# EAGLE design Rocket-Control2 (EAGLE 7.6.0)
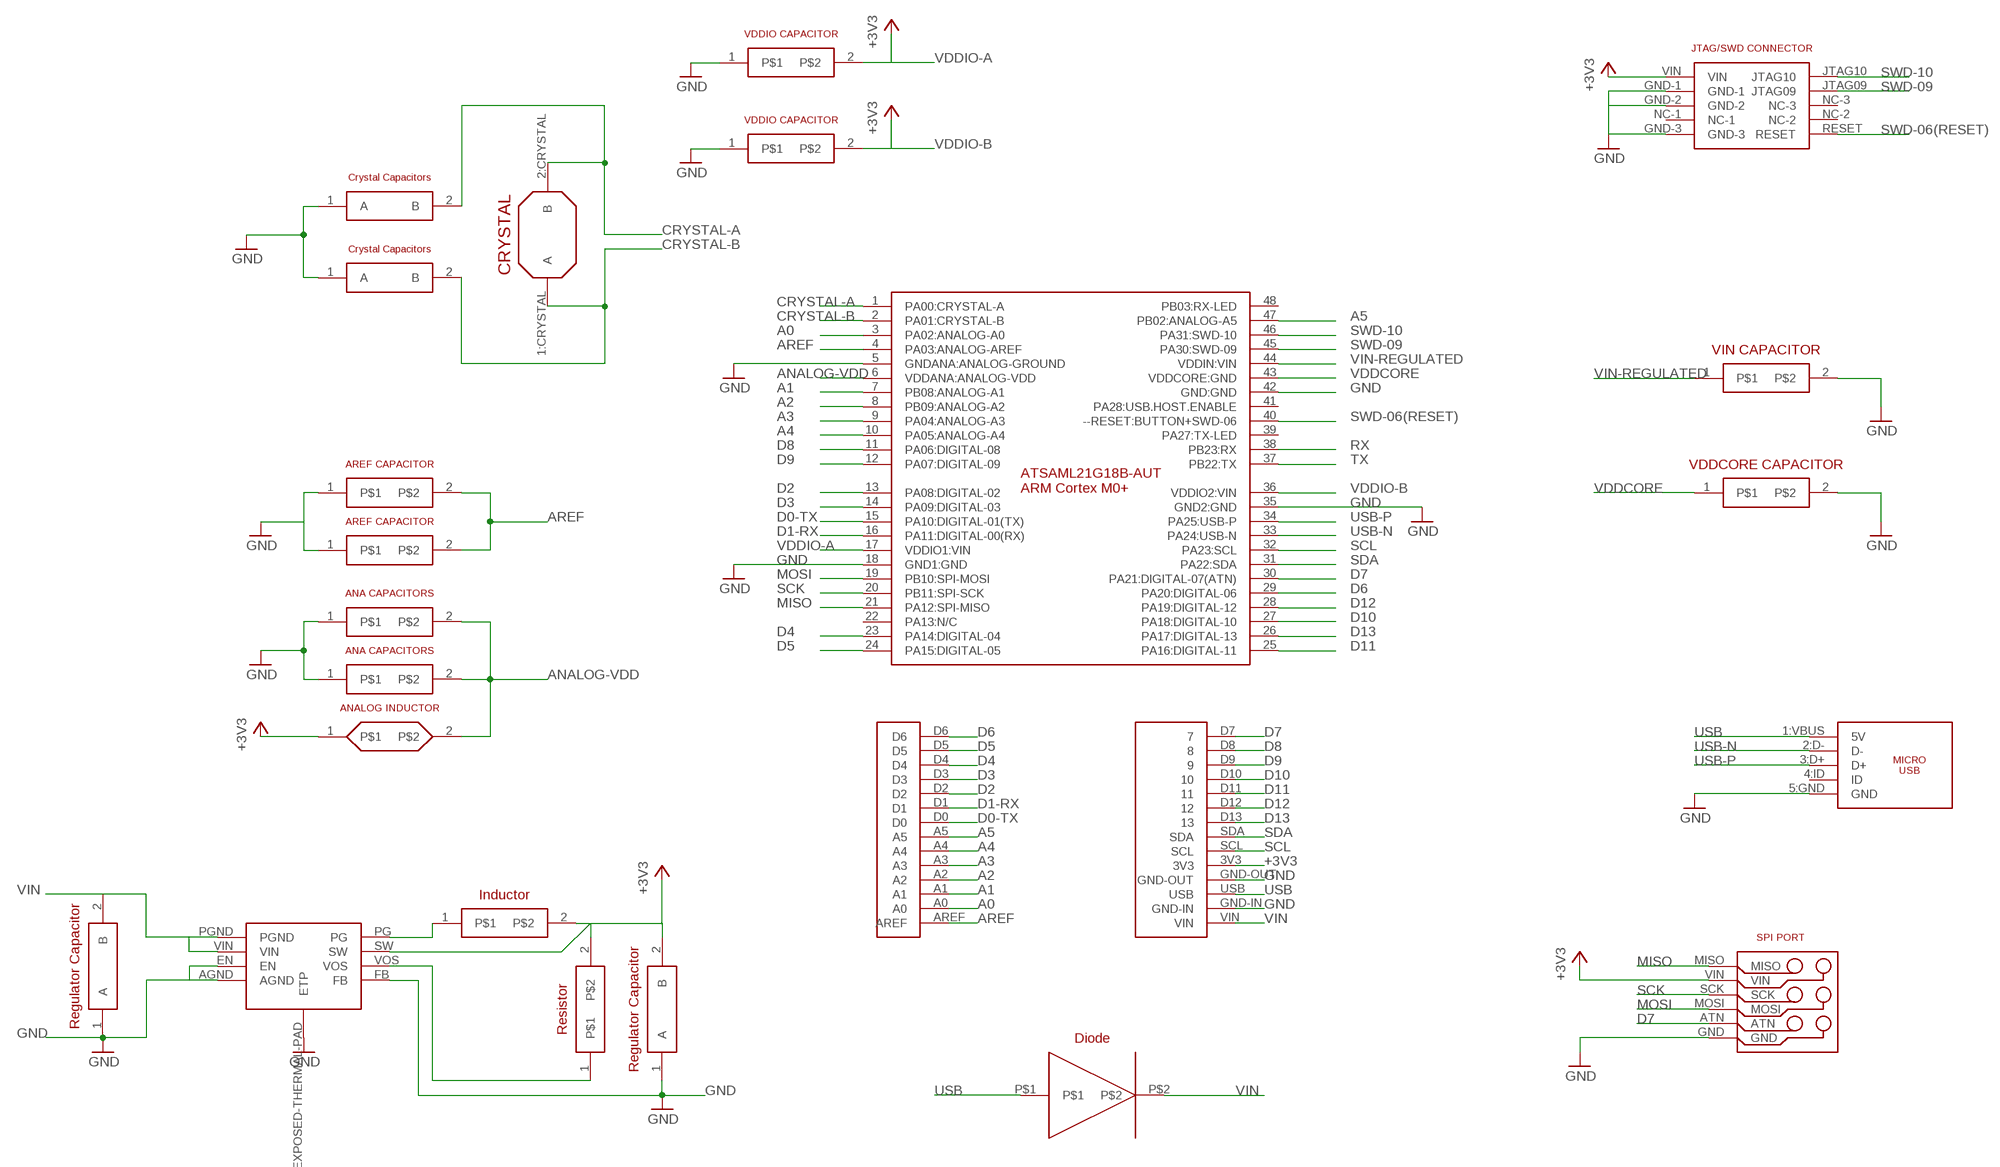
[diagram p0: schematic, sheet 1]

## Parts
U$1  ATSAML21G18B-AUT  [TQFP48]
U$2  CRYSTAL-CAPACITORS  [C0603]
U$3  CRYSTAL-CAPACITORS  [C0603]
U$4  CRYSTAL  [4-SOJ:CRYSTAL]
U$5  REGULATOR  [8-WFDFN-EXPOSED-PAD]
U$6  AREF-CAPACITORS  [C0603]
U$7  AREF-CAPACITORS  [C0603]
U$8  ANALOG-CAPACITORS  [C0603]
U$9  ANALOG-CAPACITORS  [C0603]
U$10  ANALOG-INDUCTOR  [C0603]
U$11  REGULATOR-CAPACITORS  [C0603]
U$12  REGULATOR-CAPACITORS  [C0603]
U$13  REGULATOR-INDUCTOR  [C0603]
U$14  REGULATOR-RESISTOR  [C0603]
U$15  REGULATION-DIODE  [SOD-882]
U$21  HEADER-SIDE-A  [HEADER-SIDE-A]
U$22  HEADER-SIDE-B  [HEADER-SIDE-B]
U$26  VDDIO-CAPACITOR  [C0603]
U$35  VDDIO-CAPACITOR  [C0603]
U$38  10118194-0001LF:MICRO-USB  [10118194-0001LF:MICRO-USB-B]
U$41  SPI-PORT  [SPI-PORT]
U$56  VDDCORE-CAPACITOR  [C0603]
U$57  VIN-CAPACITOR  [C0603]
U$61  JTAG-MINI  [JTAG-MINI]

## Nets
+3V3: U$5.SW U$10.1 U$12.2(B) U$13.2 U$14.2 U$22.3V3 U$41.VIN U$61.VIN
A0: U$1.3(PA02:ANALOG-A0) U$21.A0
A1: U$1.7(PB08:ANALOG-A1) U$21.A1
A2: U$1.8(PB09:ANALOG-A2) U$21.A2
A3: U$1.9(PA04:ANALOG-A3) U$21.A3
A4: U$1.10(PA05:ANALOG-A4) U$21.A4
A5: U$1.47(PB02:ANALOG-A5) U$21.A5
ANALOG-VDD: U$1.6(VDDANA:ANALOG-VDD) U$8.2 U$9.2 U$10.2
AREF: U$1.4(PA03:ANALOG-AREF) U$6.2 U$7.2 U$21.AREF
CRYSTAL-A: U$1.1(PA00:CRYSTAL-A) U$2.2(B) U$4.2:CRYSTAL(B)
CRYSTAL-B: U$1.2(PA01:CRYSTAL-B) U$3.2(B) U$4.1:CRYSTAL(A)
D0-TX: U$1.15(PA10:DIGITAL-01(TX)) U$21.D0
D1-RX: U$1.16(PA11:DIGITAL-00(RX)) U$21.D1
D2: U$1.13(PA08:DIGITAL-02) U$21.D2
D3: U$1.14(PA09:DIGITAL-03) U$21.D3
D4: U$1.23(PA14:DIGITAL-04) U$21.D4
D5: U$1.24(PA15:DIGITAL-05) U$21.D5
D6: U$1.29(PA20:DIGITAL-06) U$21.D6
D7: U$1.30(PA21:DIGITAL-07(ATN)) U$22.D7 U$41.ATN
D8: U$1.11(PA06:DIGITAL-08) U$22.D8
D9: U$1.12(PA07:DIGITAL-09) U$22.D9
D10: U$1.27(PA18:DIGITAL-10) U$22.D10
D11: U$1.25(PA16:DIGITAL-11) U$22.D11
D12: U$1.28(PA19:DIGITAL-12) U$22.D12
D13: U$1.26(PA17:DIGITAL-13) U$22.D13
GND: U$1.5(GNDANA:ANALOG-GROUND) U$1.18(GND1:GND) U$1.35(GND2:GND) U$1.42(GND:GND) U$2.1(A) U$3.1(A) U$5.AGND U$5.EN U$5.EXPOSED-THERMAL-PAD(ETP) U$5.FB U$6.1 U$7.1 U$8.1 U$9.1 U$11.1(A) U$12.1(A) U$22.GND-IN U$22.GND-OUT U$26.1 U$35.1 U$38.5:GND(GND) U$41.GND U$56.2 U$57.2 U$61.GND-1 U$61.GND-2 U$61.GND-3
MISO: U$1.21(PA12:SPI-MISO) U$41.MISO
MOSI: U$1.19(PB10:SPI-MOSI) U$41.MOSI
N$1: U$5.PG U$13.1
N$3: U$5.VOS U$14.1
RX: U$1.38(PB23:RX)
SCK: U$1.20(PB11:SPI-SCK) U$41.SCK
SCL: U$1.32(PA23:SCL) U$22.SCL
SDA: U$1.31(PA22:SDA) U$22.SDA
SWD-06(RESET): U$1.40(--RESET:BUTTON+SWD-06) U$61.RESET
SWD-09: U$1.45(PA30:SWD-09) U$61.JTAG09
SWD-10: U$1.46(PA31:SWD-10) U$61.JTAG10
TX: U$1.37(PB22:TX)
USB: U$15.P$1 U$22.USB U$38.1:VBUS(5V)
USB-N: U$1.33(PA24:USB-N) U$38.2:D-(D-)
USB-P: U$1.34(PA25:USB-P) U$38.3:D+(D+)
VDDCORE: U$1.43(VDDCORE:GND) U$56.1
VDDIO-A: U$1.17(VDDIO1:VIN) U$26.2 ; supply symbol labelled +3V3
VDDIO-B: U$1.36(VDDIO2:VIN) U$35.2 ; supply symbol labelled +3V3
VIN: U$5.PGND U$5.VIN U$11.2(B) U$15.P$2 U$22.VIN
VIN-REGULATED: U$1.44(VDDIN:VIN) U$57.1
Unconnected: U$1.22(PA13:N/C) U$1.39(PA27:TX-LED) U$1.41(PA28:USB.HOST.ENABLE) U$1.48(PB03:RX-LED) U$38.4:ID(ID) U$61.NC-1 U$61.NC-2 U$61.NC-3

## Library data of the parts
U$1 = RocketControlBoard:ATSAML21G18B-AUT
U$2 U$3 = RocketControlBoard:CRYSTAL-CAPACITORS
U$4 = RocketControlBoard:CRYSTAL
U$5 = RocketControlBoard:REGULATOR
U$6 U$7 = RocketControlBoard:AREF-CAPACITORS
U$8 U$9 = RocketControlBoard:ANALOG-CAPACITORS
U$10 = RocketControlBoard:ANALOG-INDUCTOR
U$11 U$12 = RocketControlBoard:REGULATOR-CAPACITORS
U$13 = RocketControlBoard:REGULATOR-INDUCTOR
U$14 = RocketControlBoard:REGULATOR-RESISTOR
U$15 = RocketControlBoard:REGULATION-DIODE
U$21 = RocketControlBoard:HEADER-SIDE-A
U$22 = RocketControlBoard:HEADER-SIDE-B
U$26 U$35 = RocketControlBoard:VDDIO-CAPACITOR
U$38 = RocketControlBoard:10118194-0001LF:MICRO-USB
U$41 = RocketControlBoard:SPI-PORT
U$56 = RocketControlBoard:VDDCORE-CAPACITOR
U$57 = RocketControlBoard:VIN-CAPACITOR
U$61 = RocketControlBoard:JTAG-MINI

## Board
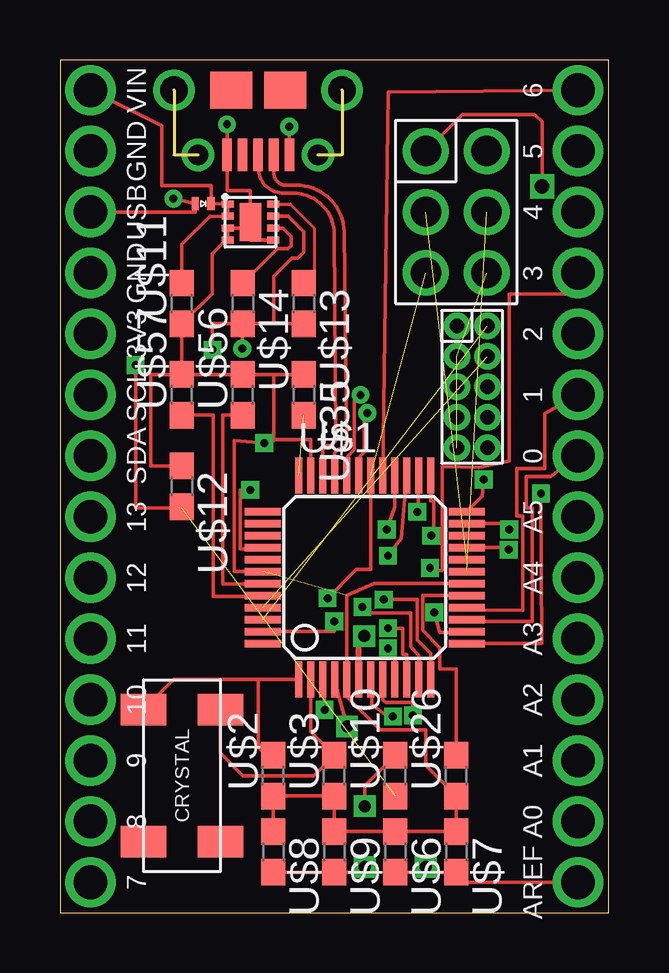
[diagram p1: board, top side]
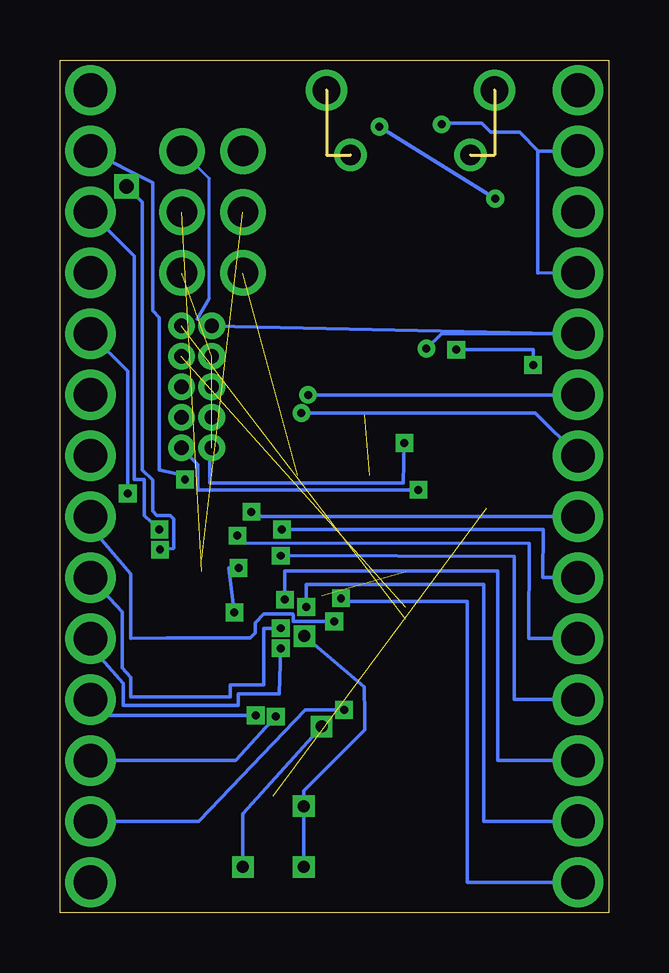
[diagram p2: board, bottom side, seen from below]

Size 22.86 x 35.55 mm. Coordinates in mm from the lower left corner, seen from the top.
Outline: 0,0 22.86,0 22.86,35.55 0,35.55 0,0
Copper layers (1*16): Top 0.035mm / dielectric 1.5mm / Bottom 0.035mm
Design rules "default": minimum track width 10mil, minimum drill 24mil, track to track 8mil, track to pad 8mil, pad to pad 8mil, via to via 8mil, smd to smd 8mil, copper to edge 40mil, drill to drill 8mil, minimum pad ring 10mil, minimum via ring 8mil, stop-mask expansion 4mil, vias tented up to drill 0mil, thermal gap 10mil

### Footprints (pad centres in the part's own frame; a part is rotated, then mirrored left to right if it is on the bottom)
TQFP48 = smd 0.3 x 1.5: 1 -2.75,-4.25; 2 -2.25,-4.25; 3 -1.75,-4.25; 4 -1.25,-4.25; 5 -0.75,-4.25; 6 -0.25,-4.25; 7 0.25,-4.25; 8 0.75,-4.25; 9 1.25,-4.25; 10 1.75,-4.25; 11 2.25,-4.25; 12 2.75,-4.25; 25 2.75,4.25; 26 2.25,4.25; 27 1.75,4.25; 28 1.25,4.25; 29 0.75,4.25; 30 0.25,4.25; 31 -0.25,4.25; 32 -0.75,4.25; 33 -1.25,4.25; 34 -1.75,4.25; 35 -2.25,4.25; 36 -2.75,4.25 | smd 1.5 x 0.3: 13 4.25,-2.75; 14 4.25,-2.25; 15 4.25,-1.75; 16 4.25,-1.25; 17 4.25,-0.75; 18 4.25,-0.25; 19 4.25,0.25; 20 4.25,0.75; 21 4.25,1.25; 22 4.25,1.75; 23 4.25,2.25; 24 4.25,2.75; 37 -4.25,2.75; 38 -4.25,2.25; 39 -4.25,1.75; 40 -4.25,1.25; 41 -4.25,0.75; 42 -4.25,0.25; 43 -4.25,-0.25; 44 -4.25,-0.75; 45 -4.25,-1.25; 46 -4.25,-1.75; 47 -4.25,-2.25; 48 -4.25,-2.75
C0603 = smd 1.1 x 1: 1 -0.85,0; 2 0.85,0
4-SOJ:CRYSTAL = smd 1.3 x 1.9: 1:CRYSTAL -2.75,1.6; 2:CRYSTAL -2.75,-1.6; 3:N/C 2.75,1.6; 4:N/C 2.75,-1.6
8-WFDFN-EXPOSED-PAD = smd 0.28 x 0.5: AGND 1.5,0; EN 1,0; FB 1.5,1.9; PG 0,1.9; PGND 0,0; SW 0.5,1.9; VIN 0.5,0; VOS 1,1.9 | smd 1.6 x 0.9: EXPOSED-THERMAL-PAD 0.75,0.95
SOD-882 = smd 0.3 x 0.55: P$1 0,0; P$2 0.65,0
HEADER-SIDE-A = drill 1.4: A0 0,-12.7; A1 0,-10.16; A2 0,-7.62; A3 0,-5.08; A4 0,-2.54; A5 0,0; AREF 0,-15.24; D0 0,2.54; D1 0,5.08; D2 0,7.62; D3 0,10.16; D4 0,12.7; D5 0,15.24; D6 0,17.78
HEADER-SIDE-B = drill 1.4: 3V3 -12.7,0; D7 -35.56,0; D8 -33.02,0; D9 -30.48,0; D10 -27.94,0; D11 -25.4,0; D12 -22.86,0; D13 -20.32,0; GND-IN -5.08,0; GND-OUT -10.16,0; SCL -15.24,0; SDA -17.78,0; USB -7.62,0; VIN -2.54,0
10118194-0001LF:MICRO-USB-B = smd 1.35 x 0.4: 1:VBUS 2.7,1.3; 2:D- 2.7,0.65; 3:D+ 2.7,0; 4:ID 2.7,-0.65; 5:GND 2.7,-1.3 | drill 0.85: NC1 2.7,2.5; NC6 2.7,-2.5 | drill 1.15: NC2 0,3.5; NC5 0,-3.5 | smd 1.55 x 1.75: NC3 0,1.125; NC4 0,-1.125
SPI-PORT = drill 1.27: ATN 0,0; GND 2.54,0; MISO 0,5.08; MOSI 2.54,2.54; SCK 0,2.54; VIN 2.54,5.08
JTAG-MINI = drill 0.6: GND-1 0.635,4.445; GND-2 0.635,3.175; GND-3 0.635,0.635; JTAG09 1.905,4.445; JTAG10 1.905,5.715; NC-1 0.635,1.905; NC-2 1.905,1.905; NC-3 1.905,3.175; RESET 1.905,0.635; VIN 0.635,5.715

### Placement (x,y rotation side)
U$1  12.7,13.97 0 top
U$2  8.89,5.71 90 top
U$3  11.43,5.71 90 top
U$4  5.08,5.71 270 top
U$5  6.99,29.54 270 top
U$6  13.97,2.54 270 top
U$7  16.51,2.54 270 top
U$8  8.89,2.54 270 top
U$9  11.43,2.54 270 top
U$10  13.97,5.71 90 top
U$11  5.08,25.4 90 top
U$12  5.08,17.78 270 top
U$13  10.16,25.4 270 top
U$14  7.62,25.4 270 top
U$15  5.64,29.57 0 top
U$21  21.59,16.51 0 top
U$22  1.27,36.83 90 top
U$26  16.51,5.71 90 top
U$35  10.16,21.59 270 top
U$38  8.26,34.29 270 top
U$41  15.24,26.67 0 top
U$56  7.62,21.59 90 top
U$57  5.08,21.59 90 top
U$61  15.9,18.75 0 top

### Tracks (layer width: path | path; a pad name or v marks a point on that pad's centre or on a via)
+3V3  (via drill 0.33)  (1 unrouted)
  Top 0.127: 8.91,24.59 8.89,24.56 7.63,24.56 U$14.2 7.59,24.52
  Top 0.152: U$5.SW 9.52,29.04 10.16,28.4 10.16,27.53 9.91,27.28 9.65,27.28 8.91,26.54 8.91,24.59 | U$13.2 U$14.2 6.35,24.55 v6.35,23.47 | v7.59,23.52 7.59,24.52 | v3.15,22.84 3.15,16.87 5.08,16.87 U$12.2
  Bottom 0.127: U$61.VIN 17.14,24.74 16.64,25.6 16.64,30.61 U$41.VIN | U$22.3V3 6.99,24.13
  Bottom 0.152: U$22.3V3 U$61.VIN | 6.99,24.13 v7.59,23.52 | v6.35,23.47 3.15,23.47 v3.15,22.84
A0  (via drill 0.33)
  Top 0.152: v11.02,8.46 11,9.67 U$1.3
  Bottom 0.152: U$21.A0 17.07,3.81 12.65,8.46 v11.02,8.46
A1  (via drill 0.33)
  Top 0.152: v13.87,8.18 13.64,8.18 12.98,8.69 12.98,9.69 U$1.7
  Bottom 0.152: U$21.A1 15.54,6.35 v13.87,8.18
A2  (via drill 0.33)
  Top 0.152: U$1.8 13.45,8.88 13.56,8.76 14.71,8.76 v14.71,8.23
  Bottom 0.152: v14.71,8.23 21.59,8.23 U$21.A2
A3  (via drill 0.33)
  Top 0.152: v13.66,11.02 13.95,11.02 U$1.9
  Bottom 0.152: U$21.A3 21.59,11.12 20.22,9.55 20.22,8.64 15.44,8.64 15.44,9.12 13.72,9.12 v13.66,11.02
A4  (via drill 0.33)
  Top 0.152: v13.66,11.86 14.28,11.86 14.28,10.77 14.45,10.77 U$1.10
  Bottom 0.152: v13.66,11.86 14.38,11.86 14.38,9.5 15.77,9.5 15.77,8.99 19.91,8.99 19.91,9.8 20.27,10.21 20.27,12.55 U$21.A4
A5  (via drill 0.33)
  Top 0.152: v11.43,12.14 11.43,11.72 U$1.47
  Bottom 0.152: U$21.A5 21.59,16.1 19.91,14.12 19.91,11.43 18.41,11.46 14.94,11.46 14.73,11.66 14.73,12.09 14.38,12.45 13.16,12.45 13.13,12.42 13.13,12.14 v11.43,12.14
ANALOG-VDD  (via drill 0.5)
  Top 0.152: U$8.2 U$9.2 12.48,1.69 v12.7,1.91 | v12.7,4.45 12.7,5.29 U$10.2
  Top 0.254: U$1.6 12.45,11.48 v12.68,11.53
  Bottom 0.152: v12.7,1.91 v12.7,4.45 12.7,5.08 10.16,7.62 10.16,8.26 10.19,9.42 v12.68,11.53
AREF  (via drill 0.5)
  Top 0.152: U$6.2 15.03,1.69 v15.24,1.91 15.46,1.69 U$7.2 | v11.96,7.76 11.43,9.7 | U$21.AREF 16.51,1.27
  Top 0.254: 11.43,9.7 U$1.4 | 16.51,1.27 U$7.2
  Bottom 0.152: v15.24,1.91 15.24,4.13 v11.96,7.76
CRYSTAL-A
  Top 0.152: U$1.1 8.26,9.72 | 8.26,9.72 4.74,9.72 U$4.2:CRYSTAL | 8.26,6.99 8.26,9.72
  Top 0.254: U$2.2 8.68,6.57 8.26,6.99
CRYSTAL-B
  Top 0.152: U$4.1:CRYSTAL 6.68,6.66 7.62,5.71 10.58,5.71 U$3.2 10.45,7.54 U$1.2
D0-TX
  Top 0.152: U$21.D0 20.45,18.19 19.43,18.19 19.43,16.87 19.68,16.87 19.68,12.14 16.95,12.14 U$1.15
D1-RX
  Top 0.152: U$21.D1 20.19,20.8 20.19,18.52 19.02,18.52 19.02,16.54 19.28,16.54 19.28,12.6 16.95,12.62 U$1.16
D2  (via drill 0.33)
  Top 0.152: v20.04,17.48 20.07,11.22 U$1.13
  Bottom 0.152: U$21.D2 20.04,22.58 v20.04,17.48
D3  (via drill 0.33)
  Top 0.152: U$21.D3 21.92,26.67 21.92,25.78 18.72,25.78 18.72,18.82 17.45,18.57 15.93,18.59 15.93,14.28 15.42,14.28 v15.42,14.38 | v15.6,12.52 15.82,11.68 16.95,11.68 U$1.14
  Bottom 0.152: v15.42,14.38 15.82,14.38 v15.6,12.52
D4  (via drill 0.33)
  Top 0.152: v18.72,15.98 18.4,16.22 U$1.23
  Bottom 0.152: U$21.D4 19.76,27.38 19.76,18.06 19.36,18.06 19.36,16.56 v18.72,15.98
D5  (via drill 0.33)
  Top 0.152: v17.65,18.06 17.6,17.37 U$1.24
  Bottom 0.152: U$21.D5 19,30.43 19,25.09 18.72,24.82 18.72,18.47 17.65,18.24 v17.65,18.06
D6
  Top 0.152: U$21.D6 13.68,34.21 U$1.29
D7  (via drill 0.33)  (1 unrouted)
  Top 0.152: v11.15,13.11 12.34,14.3 12.95,14.3 U$1.30
  Bottom 0.152: U$22.D7 5.89,1.27 5.89,12.98 11.15,12.98 v11.15,13.11
D8  (via drill 0.33)
  Top 0.152: v12.6,12.75 12.6,12.5 14.61,12.5 14.61,11.07 14.95,10.73 U$1.11
  Bottom 0.152: U$22.D8 5.21,3.81 5.21,13.69 12.6,13.69 v12.6,12.75
D9  (via drill 0.33)
  Top 0.152: v13.49,13.06 14.88,13.06 14.88,11.38 15.45,10.81 U$1.12
  Bottom 0.152: U$22.D9 4.62,6.35 4.62,14.25 13.49,14.25 v13.49,13.06
D10  (via drill 0.33)
  Top 0.152: v13.66,14.88 14.22,15.6 U$1.27
  Bottom 0.152: U$22.D10 3.94,8.89 3.94,14.86 v13.66,14.88
D11  (via drill 0.33)
  Top 0.152: v15.47,15.72 15.57,15.72 15.57,17.17 15.45,17.17 U$1.25
  Bottom 0.152: U$22.D11 3.33,11.43 3.3,15.39 15.34,15.42 v15.47,15.72
D12  (via drill 0.33)
  Top 0.152: v13.61,15.98 13.95,16.92 U$1.28
  Bottom 0.152: U$22.D12 2.74,13.97 2.72,15.98 v13.61,15.98
D13  (via drill 0.33)
  Top 0.152: v14.88,16.71 14.9,16.54 U$1.26
  Bottom 0.152: U$22.D13 14.45,16.51 v14.88,16.71
GND  (via drill 0.33)  (4 unrouted)
  Top 0.127: U$5.AGND U$5.EN 7.93,28.54 | 7.93,28.04 U$5.EXPOSED-THERMAL-PAD | U$38.5:GND
  Top 0.152: U$1.18 13.09,13.72 11.95,13.22 U$1.5 11.95,9.01 13.34,7.62 15.24,7.62 15.24,6.13 U$26.1 U$7.1 U$6.1 U$9.1 U$3.1 U$2.1 U$8.1 | U$5.FB 7.93,28.04 | 7.93,28.54 U$5.EXPOSED-THERMAL-PAD 7.93,30.1 6.96,30.1 U$38.5:GND | U$5.EN 7.98,28.54 7.98,28.83 | v6.96,32.87 U$38.5:GND | U$5.AGND 6.91,28.04 6.35,27.48 6.35,25.82 U$11.1 U$57.2 | U$57.2 U$56.2 U$35.1 8.91,22.44 8.91,19.74 | U$57.2 3.79,22.44 3.79,18.62 5.08,18.62 U$12.1 | 8.91,19.74 10.45,19.74 U$1.35 10.52,18.22 10.52,18.16 | U$1.42 7.26,14.22 7.26,19.68 v8.51,19.58 8.79,19.58 8.91,19.68 8.91,19.74
  Top 0.254: U$3.1 11.43,5.08
  Bottom 0.127: U$22.GND-OUT 2.95,26.67 | 2.95,31.75 2.95,31.77 | 6.91,32.92 v6.96,32.87
  Bottom 0.152: U$22.GND-IN 2.95,31.75 2.95,26.67 | 2.95,31.77 3.71,32.54 4.9,32.54 5.28,32.92 6.91,32.92 | U$61.GND-3 16.61,19.38 16.61,17.91 8.56,17.91 v8.51,19.58
MISO  (via drill 0.33, 0.6)
  Top 0.152: U$41.MISO 16.76,33.27 19.79,33.27 20.09,32.97 v20.09,30.28 | v18.69,15.14 18.64,15.22 U$1.21
  Bottom 0.152: v20.09,30.28 19.43,29.62 19.43,18.47 19,18.03 19,16.74 18.82,16.56 18.26,16.56 18.11,16.41 18.11,15.21 18.14,15.19 v18.69,15.14
MOSI  (1 unrouted)
N$1
  Top 0.127: U$5.PG 9.6,29.54 10.59,28.55 10.59,26.68 U$13.1
N$3
  Top 0.152: U$5.VOS 9.28,28.54 9.63,28.19 9.63,27.81 9.5,27.69 9.06,27.69 U$14.1
SCK  (1 unrouted)
SCL  (via drill 0.33)
  Top 0.152: U$1.32 11.95,18.99 12.27,19.3 12.27,21.34 v12.52,21.59
  Bottom 0.152: v12.52,21.59 U$22.SCL
SDA  (via drill 0.33)
  Top 0.152: U$1.31 12.45,18.98 12.68,19.2 12.68,20.7 v12.8,20.83
  Bottom 0.152: v12.8,20.83 3.05,20.83 U$22.SDA
SWD-06(RESET)  (via drill 0.33)
  Top 0.152: v7.92,17.63 7.52,17.63 7.52,15.16 8.45,15.16 U$1.40
  Bottom 0.152: v7.92,17.63 17.12,17.63 17.12,18.69 U$61.RESET
SWD-09  (1 unrouted)
SWD-10  (1 unrouted)
USB  (via drill 0.33)
  Top 0.127: U$15.P$1 5.64,29.21 | U$38.1:VBUS
  Top 0.152: 5.64,29.21 U$22.USB | U$38.1:VBUS v9.55,32.77 | v4.72,29.77 U$15.P$1
  Bottom 0.152: v9.55,32.77 v4.72,29.77
USB-N
  Top 0.127: U$38.2:D- 8.9,30.87
  Top 0.152: 8.9,30.87 arc90 9.4,30.33 9.83,30.33 arc-90 11.84,28.37 11.94,19.63 arc-90 11.63,19.33 arc90 11.45,19.05 U$1.33
USB-P
  Top 0.127: U$38.3:D+ 8.26,31.17
  Top 0.152: 8.26,31.17 arc90 9.25,30 9.68,30 arc-90 11.43,28.32 11.48,19.76 arc-90 11.2,19.48 arc90 10.95,19.23 U$1.34
VDDCORE
  Top 0.152: U$56.1 6.78,20.74 6.78,13.72 U$1.43
VDDIO-A
  Top 0.152: U$26.2 16.51,10.16 15.82,10.16 15.82,11.05 15.11,11.76 15.11,13.23 15.13,13.22 U$1.17
VDDIO-B  (1 unrouted)
VIN
  Top 0.127: U$15.P$2 6.31,29.54 U$5.PGND U$5.VIN 6.26,29.04
  Top 0.152: U$15.P$2 6.3,30.3 4.24,30.3 4.24,32.82 U$22.VIN | U$11.2 5.08,27.86 6.26,29.04
VIN-REGULATED
  Top 0.152: U$57.1 6.38,20.74 6.38,13.18 8.45,13.18 U$1.44